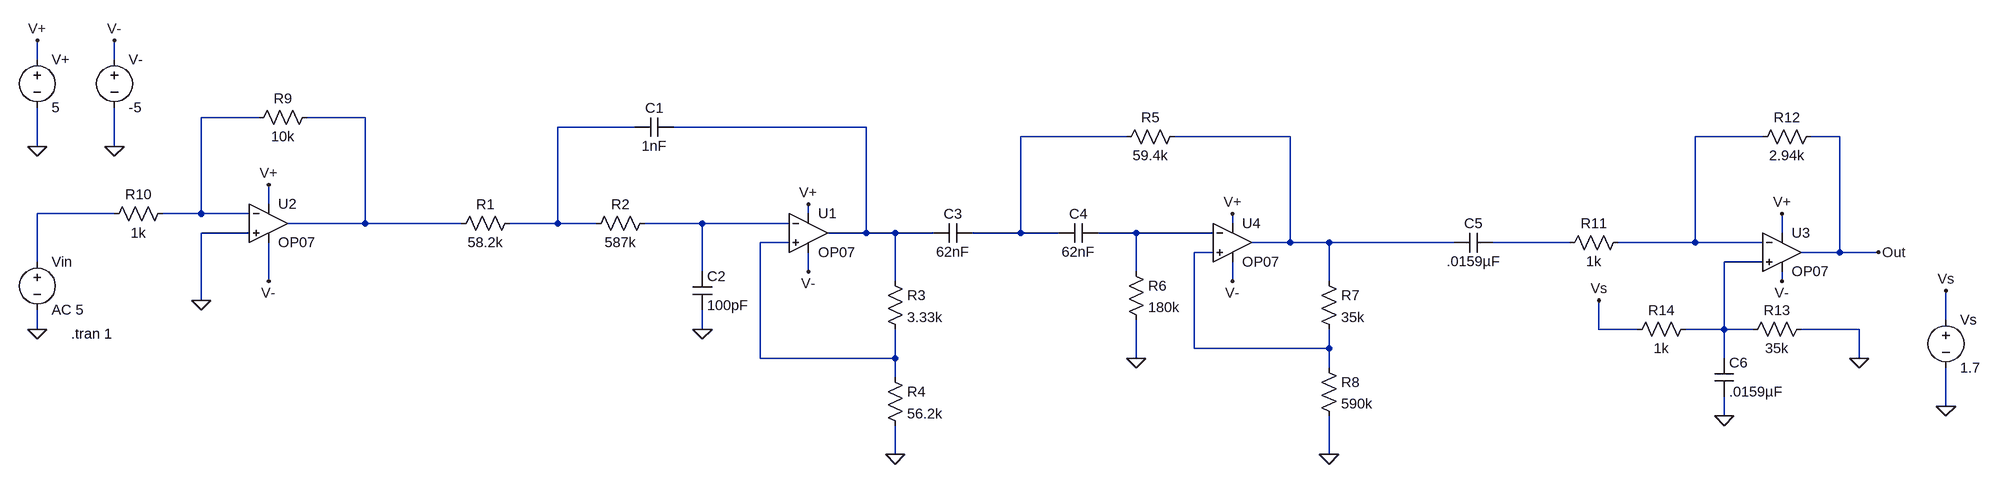
[diagram p0: schematic Analogue Front End Circuit Design.asc]
Analogue Front End Circuit Design.asc, the LTspice schematic file:
Version 4
SHEET 1 2448 872
WIRE -784 -112 -784 -144
WIRE -656 -112 -656 -144
WIRE -416 -16 -512 -16
WIRE -240 -16 -336 -16
WIRE 208 0 80 0
WIRE 592 0 272 0
WIRE 1024 16 848 16
WIRE 1296 16 1104 16
WIRE 2080 16 1968 16
WIRE 2208 16 2160 16
WIRE -784 32 -784 -32
WIRE -656 32 -656 -32
WIRE -400 128 -400 96
WIRE -656 144 -784 144
WIRE -512 144 -512 -16
WIRE -512 144 -576 144
WIRE -432 144 -512 144
WIRE 496 144 496 128
WIRE -240 160 -240 -16
WIRE -240 160 -368 160
WIRE -80 160 -240 160
WIRE 80 160 80 0
WIRE 80 160 0 160
WIRE 144 160 80 160
WIRE 320 160 224 160
WIRE 464 160 320 160
WIRE 1200 160 1200 144
WIRE -432 176 -512 176
WIRE 592 176 592 0
WIRE 592 176 528 176
WIRE 640 176 592 176
WIRE 704 176 640 176
WIRE 848 176 848 16
WIRE 848 176 768 176
WIRE 912 176 848 176
WIRE 1040 176 976 176
WIRE 1168 176 1040 176
WIRE 2112 176 2112 144
WIRE 464 192 416 192
WIRE 1296 192 1296 16
WIRE 1296 192 1232 192
WIRE 1360 192 1296 192
WIRE 1568 192 1360 192
WIRE 1760 192 1632 192
WIRE 1968 192 1968 16
WIRE 1968 192 1840 192
WIRE 2080 192 1968 192
WIRE 1168 208 1136 208
WIRE 2208 208 2208 16
WIRE 2208 208 2144 208
WIRE 2272 208 2208 208
WIRE -784 224 -784 144
WIRE 2080 224 2016 224
WIRE 320 240 320 160
WIRE 496 240 496 208
WIRE 1040 240 1040 176
WIRE -400 256 -400 192
WIRE 640 256 640 176
WIRE 1200 256 1200 224
WIRE 1360 256 1360 192
WIRE 2112 256 2112 240
WIRE -512 288 -512 176
WIRE 2384 320 2384 272
WIRE -784 336 -784 304
WIRE 320 336 320 304
WIRE 1808 336 1808 288
WIRE 1872 336 1808 336
WIRE 2016 336 2016 224
WIRE 2016 336 1952 336
WIRE 2064 336 2016 336
WIRE 2240 336 2144 336
WIRE 1136 368 1136 208
WIRE 1360 368 1360 336
WIRE 1360 368 1136 368
WIRE 416 384 416 192
WIRE 640 384 640 336
WIRE 640 384 416 384
WIRE 1040 384 1040 320
WIRE 2016 384 2016 336
WIRE 2240 384 2240 336
WIRE 1360 400 1360 368
WIRE 640 416 640 384
WIRE 2384 464 2384 400
WIRE 2016 480 2016 448
WIRE 640 544 640 496
WIRE 1360 544 1360 480
FLAG -784 336 0
FLAG 496 128 V+
FLAG -656 32 0
FLAG -784 32 0
FLAG 1200 144 V+
FLAG 1360 544 0
FLAG 640 544 0
FLAG 496 240 V-
FLAG -656 -144 V-
FLAG 1200 256 V-
FLAG 320 336 0
FLAG 1040 384 0
FLAG -784 -144 V+
FLAG -400 256 V-
FLAG -400 96 V+
FLAG -512 288 0
FLAG 2016 480 0
FLAG 2240 384 0
FLAG 2272 208 Out
FLAG 1808 288 Vs
FLAG 2384 464 0
FLAG 2384 272 Vs
FLAG 2112 256 V-
FLAG 2112 144 V+
SYMBOL res 16 144 R90
WINDOW 0 0 56 VBottom 2
WINDOW 3 32 56 VTop 2
SYMATTR InstName R1
SYMATTR Value 58.2k
SYMBOL cap 272 -16 R90
WINDOW 0 0 32 VBottom 2
WINDOW 3 32 32 VTop 2
SYMATTR InstName C1
SYMATTR Value 1nF
SYMBOL OpAmps\\OP07 496 112 R0
SYMATTR InstName U1
SYMBOL voltage -784 208 R0
WINDOW 123 24 124 Left 2
WINDOW 39 0 0 Left 0
SYMATTR InstName Vin
SYMATTR Value AC 5
SYMBOL voltage -784 -128 R0
SYMATTR InstName V+
SYMATTR Value 5
SYMBOL voltage -656 -128 R0
SYMATTR InstName V-
SYMATTR Value -5
SYMBOL cap 976 160 R90
WINDOW 0 0 32 VBottom 2
WINDOW 3 32 32 VTop 2
SYMATTR InstName C4
SYMATTR Value 62nF
SYMBOL OpAmps\\OP07 1200 128 R0
SYMATTR InstName U4
SYMBOL res 624 240 R0
SYMATTR InstName R3
SYMATTR Value 3.33k
SYMBOL res 624 400 R0
SYMATTR InstName R4
SYMATTR Value 56.2k
SYMBOL res 1344 240 R0
SYMATTR InstName R7
SYMATTR Value 35k
SYMBOL res 1344 384 R0
SYMATTR InstName R8
SYMATTR Value 590k
SYMBOL res 240 144 R90
WINDOW 0 0 56 VBottom 2
WINDOW 3 32 56 VTop 2
SYMATTR InstName R2
SYMATTR Value 587k
SYMBOL cap 304 240 R0
SYMATTR InstName C2
SYMATTR Value 100pF
SYMBOL cap 768 160 R90
WINDOW 0 0 32 VBottom 2
WINDOW 3 32 32 VTop 2
SYMATTR InstName C3
SYMATTR Value 62nF
SYMBOL res 1024 224 R0
SYMATTR InstName R6
SYMATTR Value 180k
SYMBOL res 1120 0 R90
WINDOW 0 0 56 VBottom 2
WINDOW 3 32 56 VTop 2
SYMATTR InstName R5
SYMATTR Value 59.4k
SYMBOL OpAmps\\OP07 -400 96 R0
SYMATTR InstName U2
SYMBOL res -320 -32 R90
WINDOW 0 0 56 VBottom 2
WINDOW 3 32 56 VTop 2
SYMATTR InstName R9
SYMATTR Value 10k
SYMBOL res -560 128 R90
WINDOW 0 0 56 VBottom 2
WINDOW 3 32 56 VTop 2
SYMATTR InstName R10
SYMATTR Value 1k
SYMBOL cap 1632 176 R90
WINDOW 0 0 32 VBottom 2
WINDOW 3 32 32 VTop 2
SYMATTR InstName C5
SYMATTR Value .0159µF
SYMBOL res 1856 176 R90
WINDOW 0 0 56 VBottom 2
WINDOW 3 32 56 VTop 2
SYMATTR InstName R11
SYMATTR Value 1k
SYMBOL OpAmps\\OP07 2112 144 R0
SYMATTR InstName U3
SYMBOL res 2176 0 R90
WINDOW 0 0 56 VBottom 2
WINDOW 3 32 56 VTop 2
SYMATTR InstName R12
SYMATTR Value 2.94k
SYMBOL cap 2000 384 R0
SYMATTR InstName C6
SYMATTR Value .0159µF
SYMBOL res 2160 320 R90
WINDOW 0 0 56 VBottom 2
WINDOW 3 32 56 VTop 2
SYMATTR InstName R13
SYMATTR Value 35k
SYMBOL res 1968 320 R90
WINDOW 0 0 56 VBottom 2
WINDOW 3 32 56 VTop 2
SYMATTR InstName R14
SYMATTR Value 1k
SYMBOL voltage 2384 304 R0
SYMATTR InstName Vs
SYMATTR Value 1.7
TEXT -728 344 Left 2 !.tran 1

The netlist it stands for:
* Analogue Front End Circuit Design.asc
R1 N003 N002 58.2k
C1 N004 N003 1nF
XU1 N011 N009 V+ V- N004 LT1001  ; OP07, pins In+ In- V+ V- OUT
Vin N008 0 AC 5
V+ V+ 0 5
V- V- 0 -5
C4 N010 N005 62nF
XU4 N013 N010 V+ V- N006 LT1001  ; OP07, pins In+ In- V+ V- OUT
R3 N004 N011 3.33k
R4 N011 0 56.2k
R7 N006 N013 35k
R8 N013 0 590k
R2 N009 N003 587k
C2 N009 0 100pF
C3 N005 N004 62nF
R6 N010 0 180k
R5 N006 N005 59.4k
XU2 0 N001 V+ V- N002 LT1001  ; OP07, pins In+ In- V+ V- OUT
R9 N002 N001 10k
R10 N001 N008 1k
C5 N012 N006 .0159µF
R11 N007 N012 1k
XU3 N014 N007 V+ V- Out LT1001  ; OP07, pins In+ In- V+ V- OUT
R12 Out N007 2.94k
C6 N014 0 .0159µF
R13 0 N014 35k
R14 N014 Vs 1k
Vs Vs 0 1.7
.tran 1
.lib LTC.lib
.backanno
.end